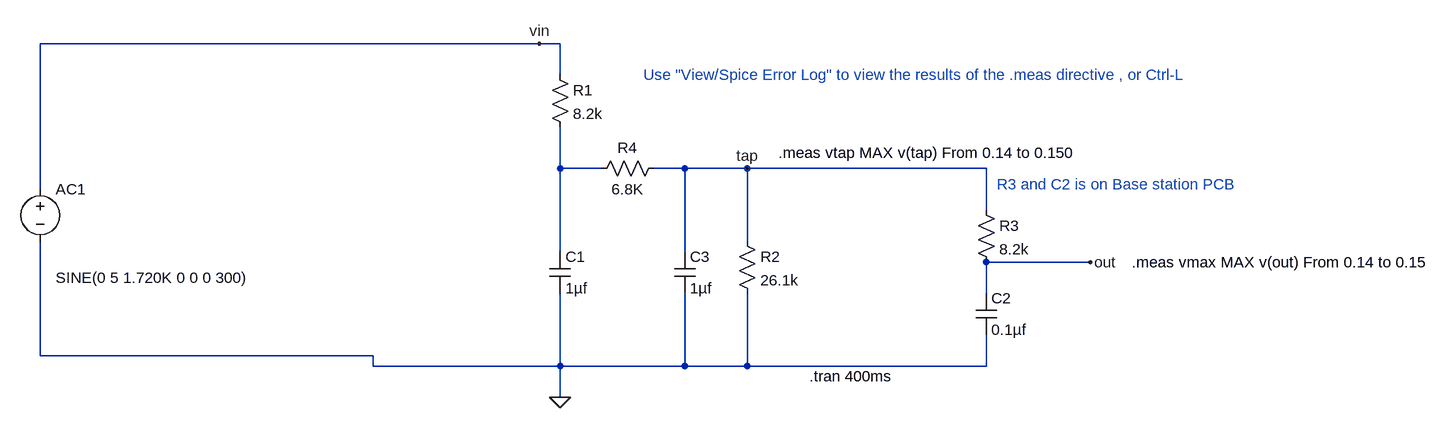
[diagram p0: schematic rc-rc.asc]
rc-rc.asc, the LTspice schematic file:
Version 4
SHEET 1 1464 680
WIRE 16 -48 -752 -48
WIRE 48 -48 16 -48
WIRE 48 0 48 -48
WIRE 48 144 48 80
WIRE 112 144 48 144
WIRE 240 144 192 144
WIRE 336 144 240 144
WIRE 704 144 336 144
WIRE -752 176 -752 -48
WIRE 704 208 704 144
WIRE 336 256 336 144
WIRE 48 272 48 144
WIRE 240 272 240 144
WIRE 864 288 704 288
WIRE 704 336 704 288
WIRE -752 432 -752 256
WIRE -240 432 -752 432
WIRE -240 448 -240 432
WIRE 48 448 48 336
WIRE 48 448 -240 448
WIRE 240 448 240 336
WIRE 240 448 48 448
WIRE 336 448 336 336
WIRE 336 448 240 448
WIRE 704 448 704 400
WIRE 704 448 336 448
WIRE 48 496 48 448
FLAG 48 496 0
FLAG 864 288 out
FLAG 16 -48 vin
FLAG 336 144 tap
SYMBOL res 320 240 R0
SYMATTR InstName R2
SYMATTR Value 26.1k
SYMBOL cap 32 272 R0
SYMATTR InstName C1
SYMATTR Value 1µf
SYMATTR SpiceLine V=10 Irms=11.456 Rser=0.004 Lser=0
SYMBOL voltage -752 160 R0
WINDOW 3 24 152 Left 2
WINDOW 123 24 124 Left 2
WINDOW 39 0 0 Left 2
SYMATTR Value SINE(0 5 1.720K 0 0 0 300)
SYMATTR InstName AC1
SYMBOL res 32 -16 R0
SYMATTR InstName R1
SYMATTR Value 8.2k
SYMATTR SpiceLine pwr=0.125
SYMBOL res 688 192 R0
SYMATTR InstName R3
SYMATTR Value 8.2k
SYMBOL res 208 128 R90
WINDOW 0 0 56 VBottom 2
WINDOW 3 32 56 VTop 2
SYMATTR InstName R4
SYMATTR Value 6.8K
SYMBOL cap 224 272 R0
SYMATTR InstName C3
SYMATTR Value 1µf
SYMBOL cap 688 336 R0
SYMATTR InstName C2
SYMATTR Value 0.1µf
TEXT 432 464 Left 2 !.tran 400ms
TEXT 928 288 Left 2 !.meas vmax MAX v(out) From 0.14 to 0.15
TEXT 176 0 Left 2 ;Use "View/Spice Error Log" to view the results of the .meas directive , or Ctrl-L
TEXT 384 120 Left 2 !.meas vtap MAX v(tap) From 0.14 to 0.150
TEXT 720 168 Left 2 ;R3 and C2 is on Base station PCB

The netlist it stands for:
* rc-rc.asc
R2 tap 0 26.1k
C1 N001 0 1µf V=10 Irms=11.456 Rser=0.004 Lser=0
V§AC1 vin 0 SINE(0 5 1.720K 0 0 0 300)
R1 vin N001 8.2k pwr=0.125
R3 tap out 8.2k
R4 tap N001 6.8K
C3 tap 0 1µf
C2 out 0 0.1µf
.tran 400ms
.meas vmax MAX v(out) From 0.14 to 0.15
* Use "View/Spice Error Log" to view the results of the .meas directive , or Ctrl-L
.meas vtap MAX v(tap) From 0.14 to 0.150
* R3 and C2 is on Base station PCB
.backanno
.end